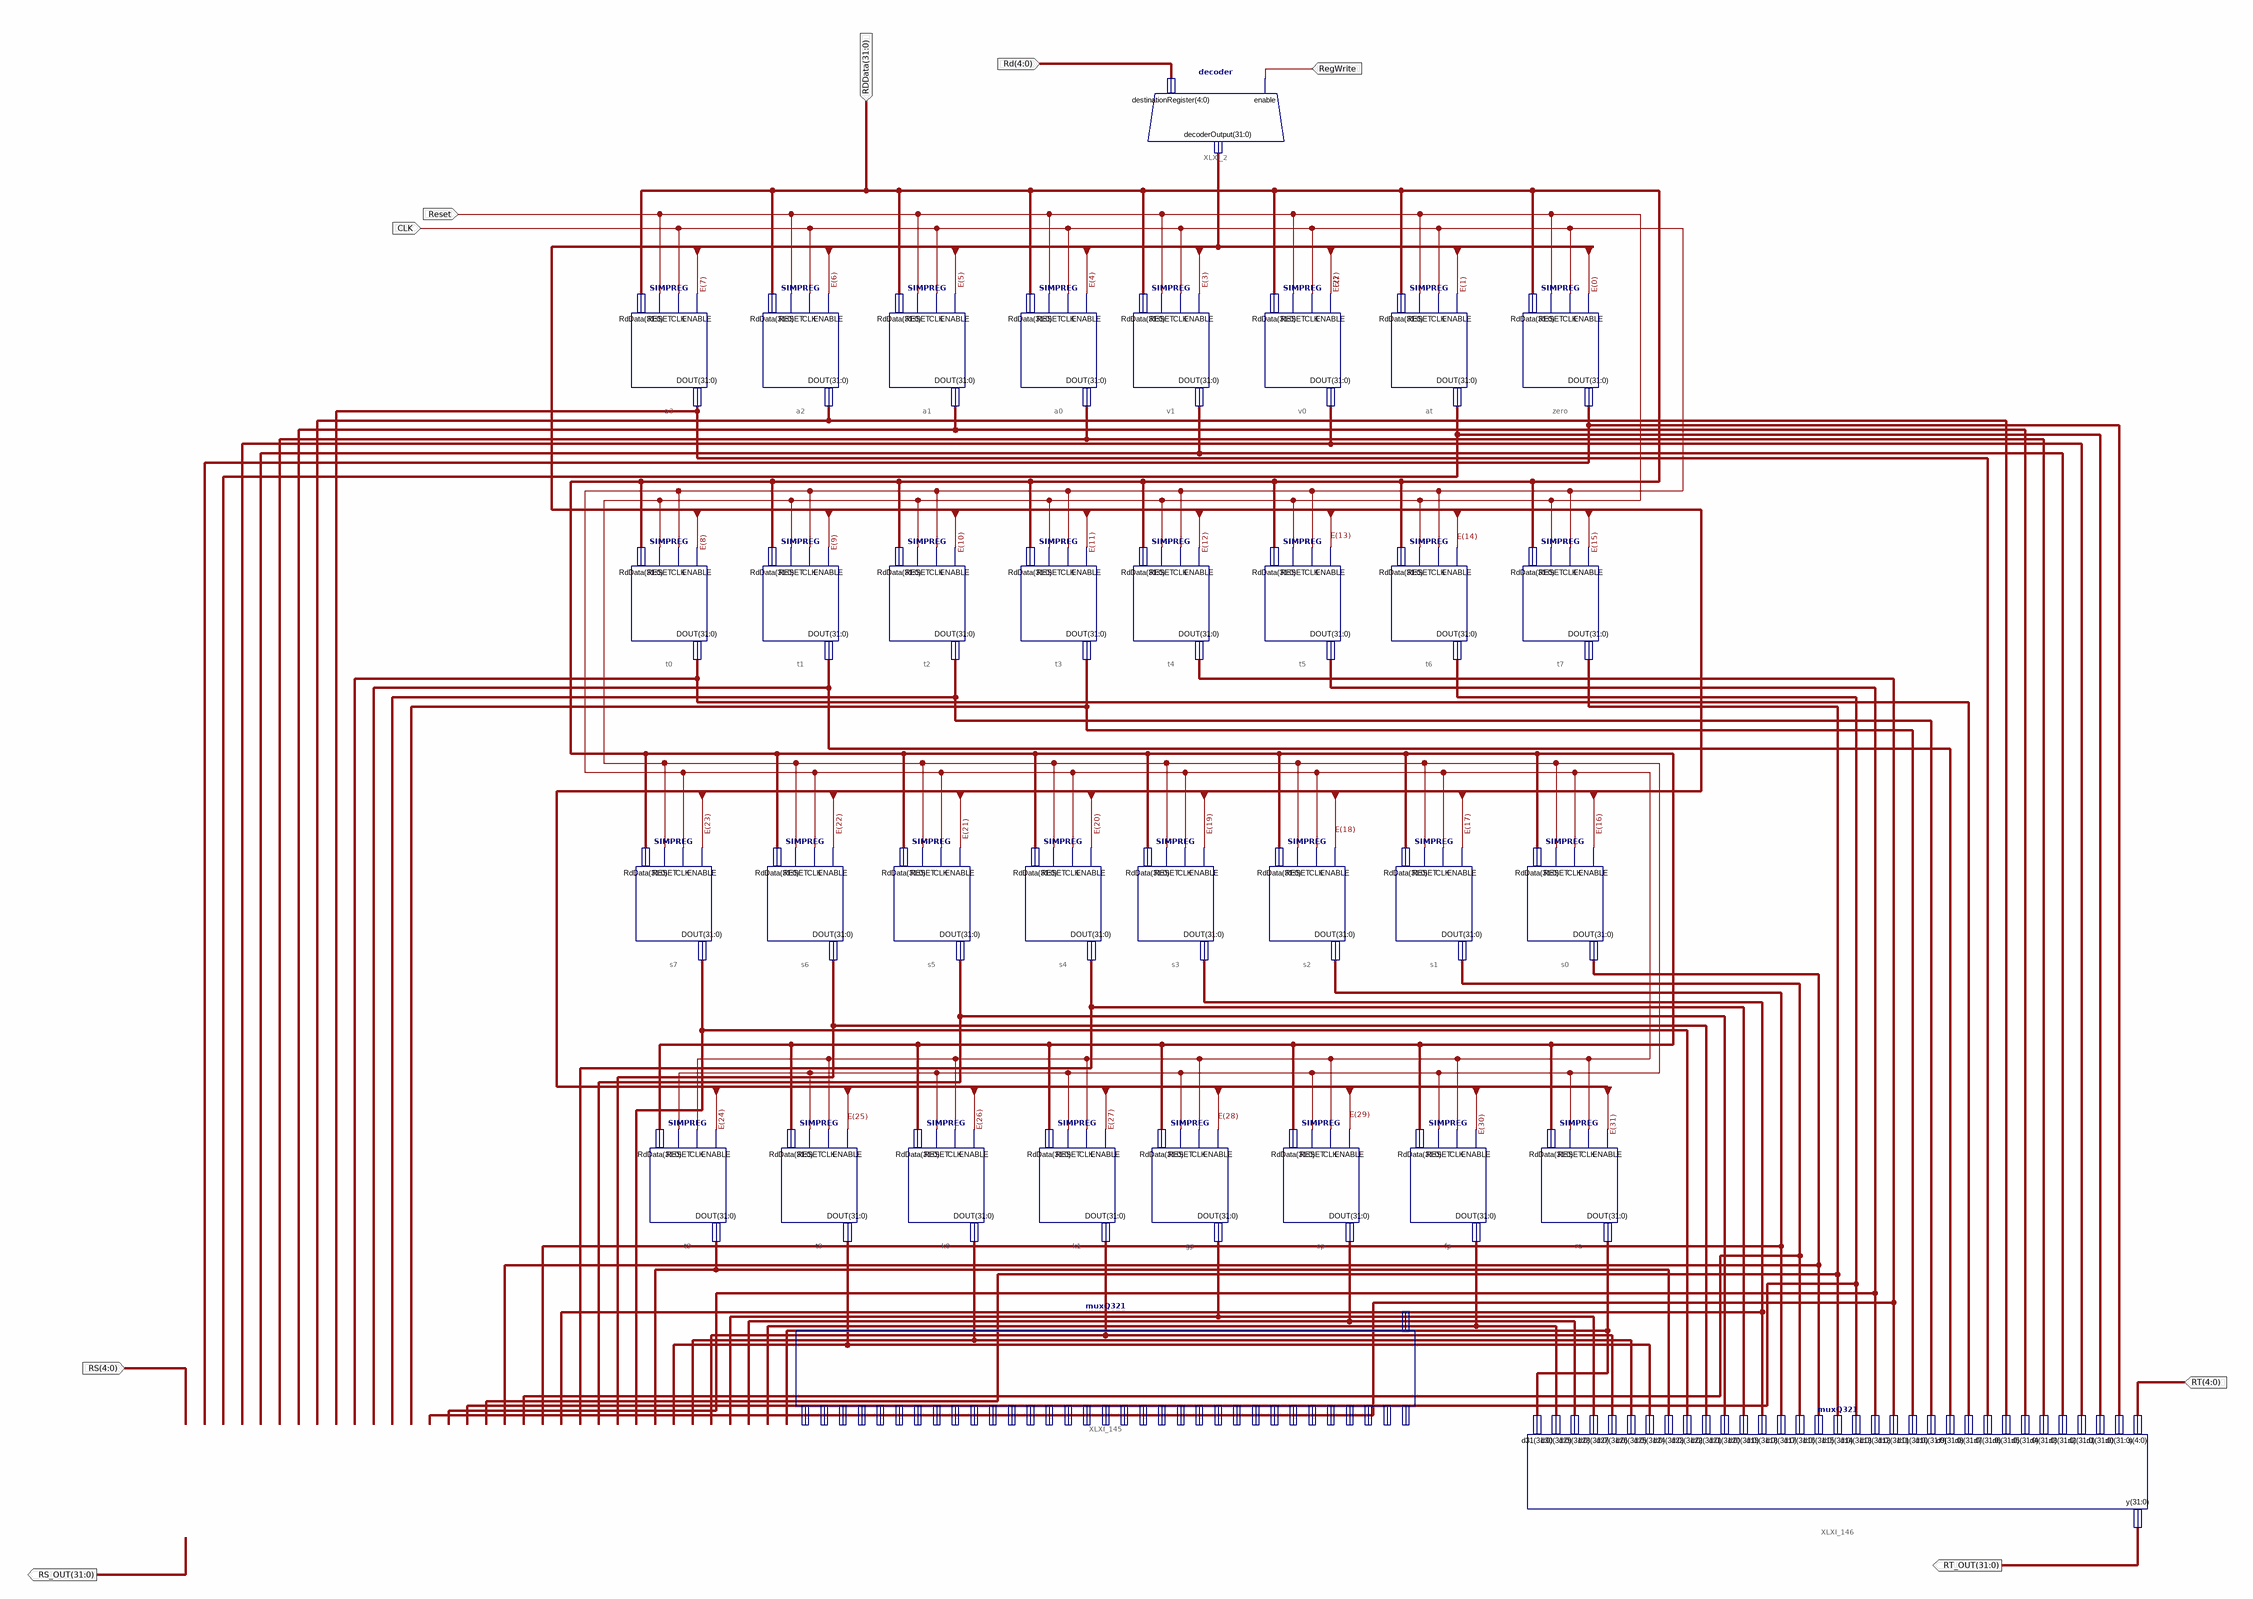
[diagram p0: schematic sheet 1]
// Xilinx ISE schematic RegisterFile.sch (artix7) as structural Verilog: 35 symbols, 9 ports
module RegisterFile (
  input  [31:0] RDData,
  input  CLK,
  input  Reset,
  input  [4:0] RS,
  input  [4:0] RT,
  input  [4:0] Rd,
  input  RegWrite,
  output [31:0] RS_OUT,
  output [31:0] RT_OUT
);

  wire [31:0] a0_reg, a1_reg, a2_reg, a3_reg, at_reg, E, fp_reg, gp_reg, k0_reg, k1_reg, ra_reg, s0_reg,
       s1_reg, s2_reg, s3_reg, s4_reg, s5_reg, s6_reg, s7_reg, sp_reg, t0_reg, t1_reg, t2_reg, t3_reg,
       t4_reg, t5_reg, t6_reg, t7_reg, t8_reg, t9_reg, v0_reg, v1_reg, zero_reg;

  muxQ321 XLXI_145 (
    .s(RS), .d0(zero_reg), .d1(at_reg), .d2(v0_reg), .d3(v1_reg), .d4(a0_reg), .d5(a1_reg), .d6(a2_reg),
    .d7(a3_reg), .d8(t0_reg), .d9(t1_reg), .d10(t2_reg), .d11(t3_reg), .d12(t4_reg), .d13(t5_reg),
    .d14(t6_reg), .d15(t7_reg), .d16(s0_reg), .d17(s1_reg), .d18(s2_reg), .d19(s3_reg), .d20(s4_reg),
    .d21(s5_reg), .d22(s6_reg), .d23(s7_reg), .d24(t8_reg), .d25(t9_reg), .d26(k0_reg), .d27(k1_reg),
    .d28(gp_reg), .d29(sp_reg), .d30(fp_reg), .d31(ra_reg), .y(RS_OUT));
  muxQ321 XLXI_146 (
    .s(RT), .d0(zero_reg), .d1(at_reg), .d2(v0_reg), .d3(v1_reg), .d4(a0_reg), .d5(a1_reg), .d6(a2_reg),
    .d7(a3_reg), .d8(t0_reg), .d9(t1_reg), .d10(t2_reg), .d11(t3_reg), .d12(t4_reg), .d13(t5_reg),
    .d14(t6_reg), .d15(t7_reg), .d16(s0_reg), .d17(s1_reg), .d18(s2_reg), .d19(s3_reg), .d20(s4_reg),
    .d21(s5_reg), .d22(s6_reg), .d23(s7_reg), .d24(t8_reg), .d25(t9_reg), .d26(k0_reg), .d27(k1_reg),
    .d28(gp_reg), .d29(sp_reg), .d30(fp_reg), .d31(ra_reg), .y(RT_OUT));
  SIMPREG t0 (.ENABLE(E[8]), .CLK(CLK), .RESET(Reset), .RdData(RDData), .DOUT(t0_reg));
  SIMPREG s4 (.ENABLE(E[20]), .CLK(CLK), .RESET(Reset), .RdData(RDData), .DOUT(s4_reg));
  SIMPREG s1 (.ENABLE(E[17]), .CLK(CLK), .RESET(Reset), .RdData(RDData), .DOUT(s1_reg));
  SIMPREG s2 (.ENABLE(E[18]), .CLK(CLK), .RESET(Reset), .RdData(RDData), .DOUT(s2_reg));
  SIMPREG s3 (.ENABLE(E[19]), .CLK(CLK), .RESET(Reset), .RdData(RDData), .DOUT(s3_reg));
  SIMPREG s5 (.ENABLE(E[21]), .CLK(CLK), .RESET(Reset), .RdData(RDData), .DOUT(s5_reg));
  SIMPREG s6 (.ENABLE(E[22]), .CLK(CLK), .RESET(Reset), .RdData(RDData), .DOUT(s6_reg));
  SIMPREG s7 (.ENABLE(E[23]), .CLK(CLK), .RESET(Reset), .RdData(RDData), .DOUT(s7_reg));
  SIMPREG s0 (.ENABLE(E[16]), .CLK(CLK), .RESET(Reset), .RdData(RDData), .DOUT(s0_reg));
  decoder XLXI_2 (.enable(RegWrite), .decoderOutput(E), .destinationRegister(Rd));
  SIMPREG t7 (.ENABLE(E[15]), .CLK(CLK), .RESET(Reset), .RdData(RDData), .DOUT(t7_reg));
  SIMPREG t6 (.ENABLE(E[14]), .CLK(CLK), .RESET(Reset), .RdData(RDData), .DOUT(t6_reg));
  SIMPREG t5 (.ENABLE(E[13]), .CLK(CLK), .RESET(Reset), .RdData(RDData), .DOUT(t5_reg));
  SIMPREG t4 (.ENABLE(E[12]), .CLK(CLK), .RESET(Reset), .RdData(RDData), .DOUT(t4_reg));
  SIMPREG t3 (.ENABLE(E[11]), .CLK(CLK), .RESET(Reset), .RdData(RDData), .DOUT(t3_reg));
  SIMPREG t1 (.ENABLE(E[9]), .CLK(CLK), .RESET(Reset), .RdData(RDData), .DOUT(t1_reg));
  SIMPREG zero (.ENABLE(E[0]), .CLK(CLK), .RESET(Reset), .RdData(RDData), .DOUT(zero_reg));
  SIMPREG at (.ENABLE(E[1]), .CLK(CLK), .RESET(Reset), .RdData(RDData), .DOUT(at_reg));
  SIMPREG v0 (.ENABLE(E[2]), .CLK(CLK), .RESET(Reset), .RdData(RDData), .DOUT(v0_reg));
  SIMPREG v1 (.ENABLE(E[3]), .CLK(CLK), .RESET(Reset), .RdData(RDData), .DOUT(v1_reg));
  SIMPREG a0 (.ENABLE(E[4]), .CLK(CLK), .RESET(Reset), .RdData(RDData), .DOUT(a0_reg));
  SIMPREG a1 (.ENABLE(E[5]), .CLK(CLK), .RESET(Reset), .RdData(RDData), .DOUT(a1_reg));
  SIMPREG a2 (.ENABLE(E[6]), .CLK(CLK), .RESET(Reset), .RdData(RDData), .DOUT(a2_reg));
  SIMPREG a3 (.ENABLE(E[7]), .CLK(CLK), .RESET(Reset), .RdData(RDData), .DOUT(a3_reg));
  SIMPREG t9 (.ENABLE(E[25]), .CLK(CLK), .RESET(Reset), .RdData(RDData), .DOUT(t9_reg));
  SIMPREG k0 (.ENABLE(E[26]), .CLK(CLK), .RESET(Reset), .RdData(RDData), .DOUT(k0_reg));
  SIMPREG k1 (.ENABLE(E[27]), .CLK(CLK), .RESET(Reset), .RdData(RDData), .DOUT(k1_reg));
  SIMPREG gp (.ENABLE(E[28]), .CLK(CLK), .RESET(Reset), .RdData(RDData), .DOUT(gp_reg));
  SIMPREG sp (.ENABLE(E[29]), .CLK(CLK), .RESET(Reset), .RdData(RDData), .DOUT(sp_reg));
  SIMPREG fp (.ENABLE(E[30]), .CLK(CLK), .RESET(Reset), .RdData(RDData), .DOUT(fp_reg));
  SIMPREG ra (.ENABLE(E[31]), .CLK(CLK), .RESET(Reset), .RdData(RDData), .DOUT(ra_reg));
  SIMPREG t8 (.ENABLE(E[24]), .CLK(CLK), .RESET(Reset), .RdData(RDData), .DOUT(t8_reg));
  SIMPREG t2 (.ENABLE(E[10]), .CLK(CLK), .RESET(Reset), .RdData(RDData), .DOUT(t2_reg));
endmodule
